# Altium schematic sheet MPPT.SchDoc
size A3
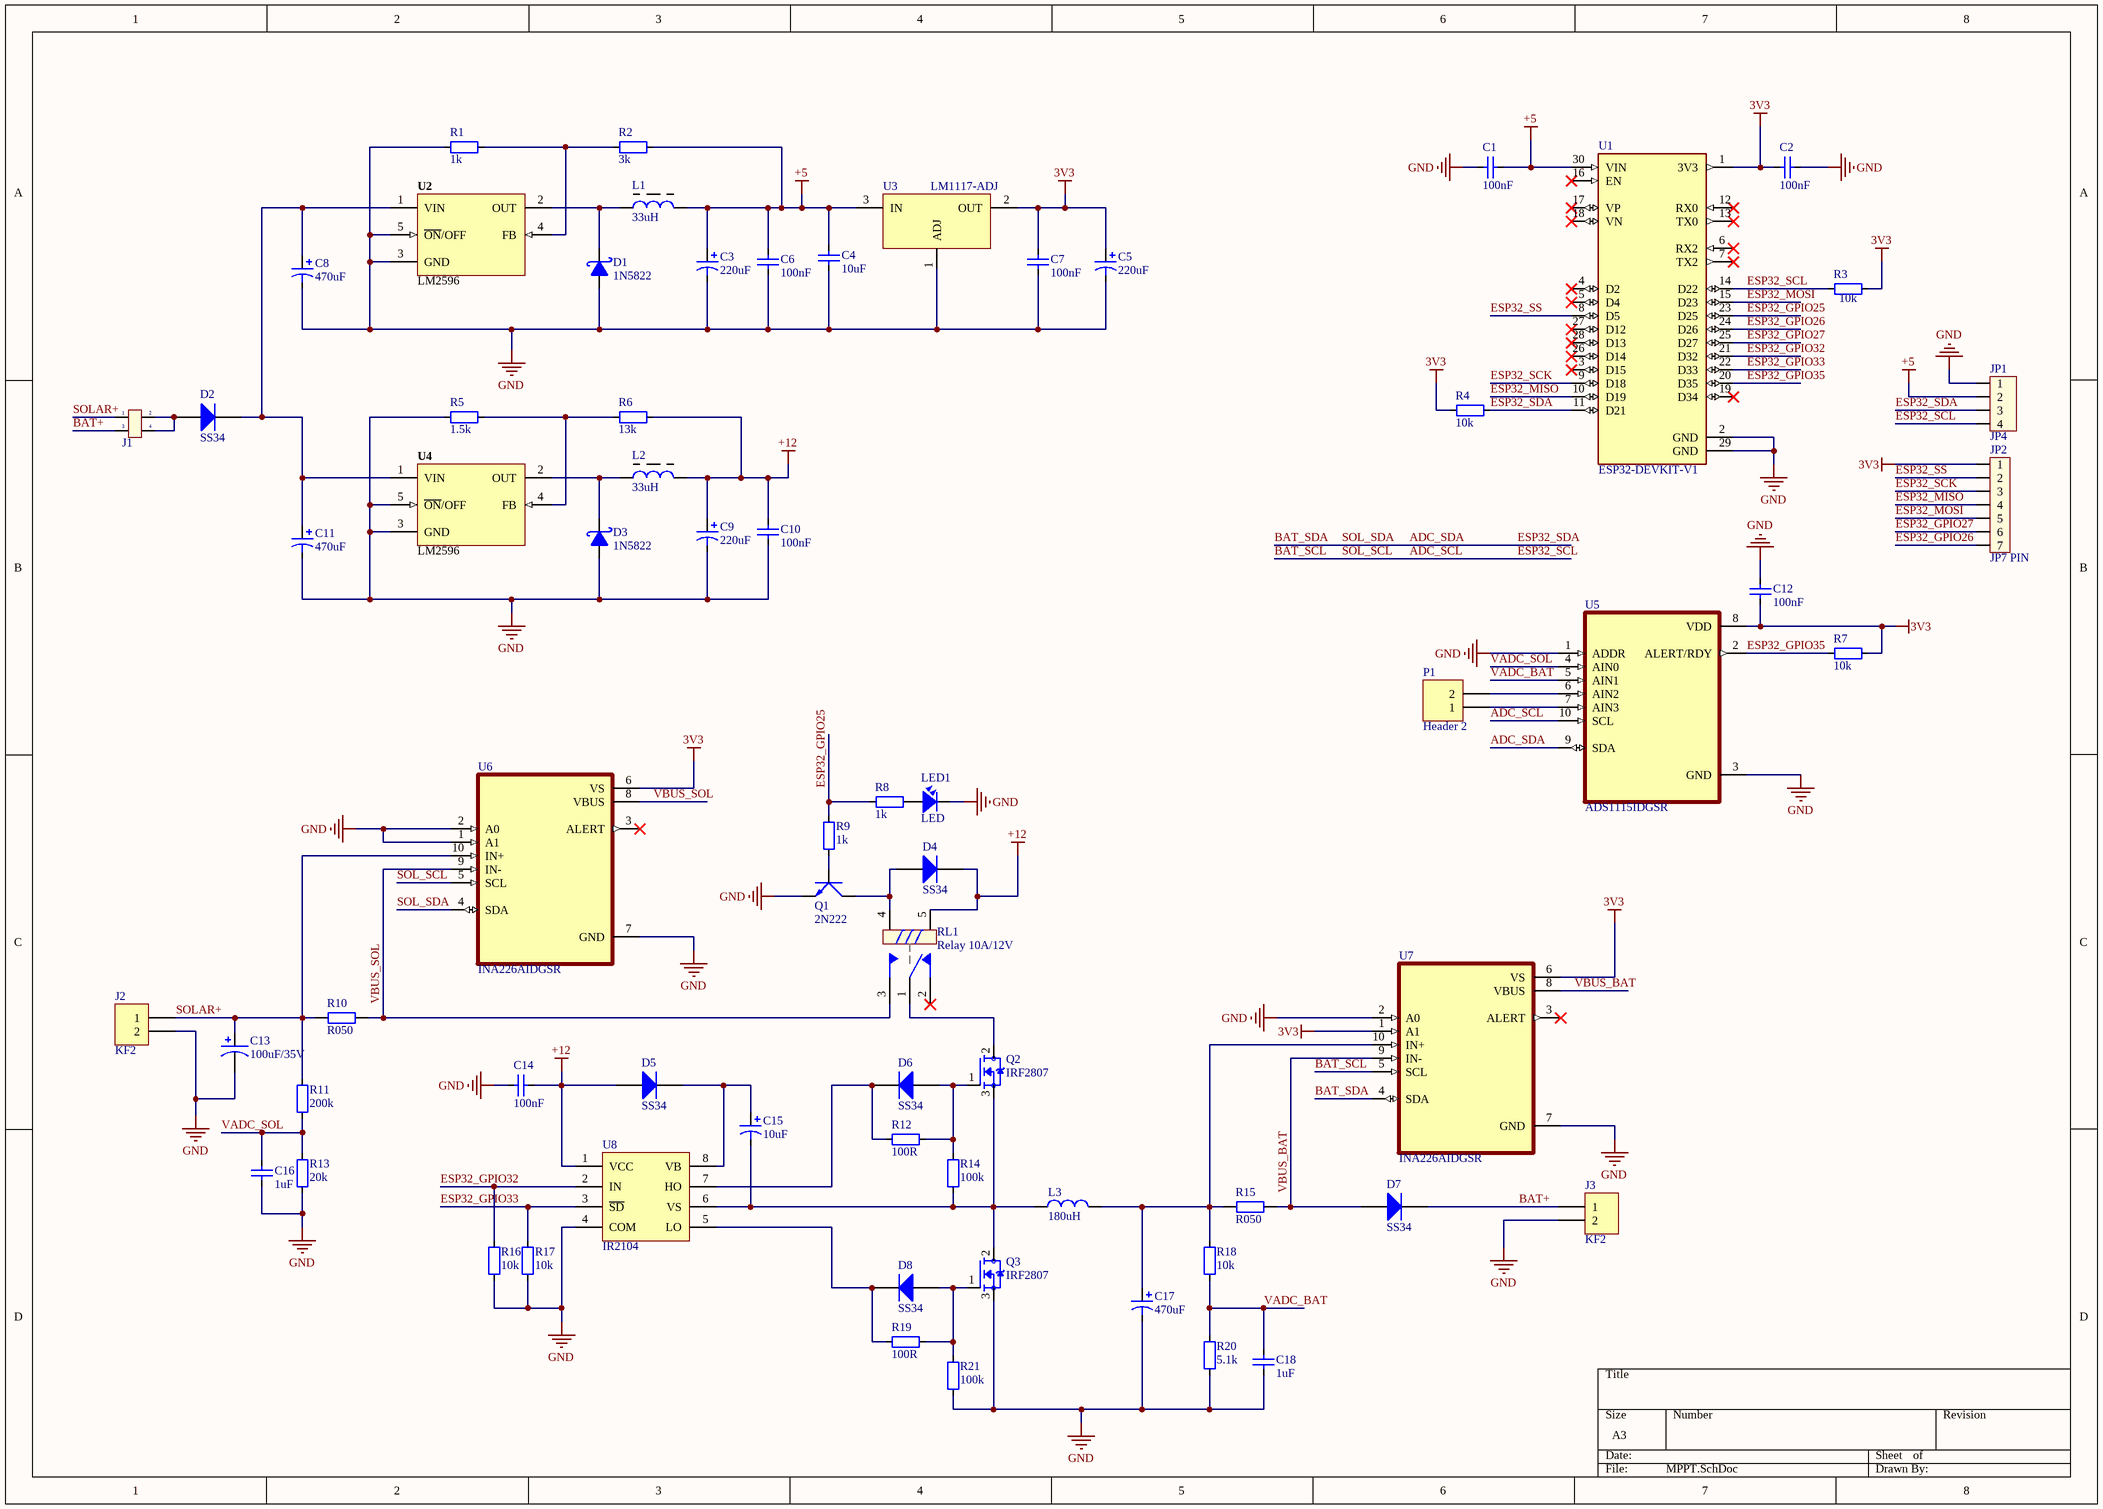
[diagram p0: MPPT.SchDoc]

## Parts
C1  100nF  [CAP_0805]
C2  100nF  [CAP_0805]
C3  220uF  [C8mm]
C4  10uF  [CAP_0805]
C5  220uF  [C8mm]
C6  100nF  [CAP_0805]
C7  100nF  [CAP_0805]
C8  470uF  [C8mm]
C9  220uF  [C8mm]
C10  100nF  [CAP_0805]
C11  470uF  [C8mm]
C12  100nF  [CAP_0805]
C13  100uF/35V  [CA-ALU-6.3]
C14  100nF  [CAP_0805]
C15  10uF  [CAP_35TQC10MYF]
C16  1uF  [CAP_0805]
C17  470uF  [C8mm]
C18  1uF  [CAP_0805]
D1  1N5822  [SMA]
D2  SS34  [SMA]
D3  1N5822  [SMA]
D4  SS34  [SMA]
D5  SS34  [SMA]
D6  SS34  [SMA]
D7  SS34  [SMA]
D8  SS34  [SMA]
J1  Jumper 2x2  [HDR2X2]  (value not drawn)
J2  KF2  [KF2-5.08T]
J3  KF2  [KF2-5.08T]
JP1  JP4  [CON4]
JP2  JP7 PIN  [JP7]
L1  33uH  [L-SMD-M-7.3x4.5]
L2  33uH  [L-SMD-M-7.3x4.5]
L3  180uH  [L-DIP-M-13.5x6]
LED1  LED  [LED-0805-Red]
P1  Header 2  [HDR1X2]
Q1  2N222  [SOT23]
Q2  IRF2807  [TO-220]
Q3  IRF2807  [TO-220]
R1  1k  [RES-SMD-0805]
R2  3k  [RES-SMD-0805]
R3  10k  [RES-SMD-0805]
R4  10k  [RES-SMD-0805]
R5  1.5k  [RES-SMD-0805]
R6  13k  [RES-SMD-0805]
R7  10k  [RES-SMD-0805]
R8  1k  [RES-SMD-0805]
R9  1k  [RES-SMD-0805]
R10  R050  [RES-SMD-2512]
R11  200k  [RES-SMD-0805]
R12  100R  [RES-SMD-0805]
R13  20k  [RES-SMD-0805]
R14  100k  [RES-SMD-0805]
R15  R050  [RES-SMD-2512]
R16  10k  [RES-SMD-0805]
R17  10k  [RES-SMD-0805]
R18  10k  [RES-SMD-0805]
R19  100R  [RES-SMD-0805]
R20  5.1k  [RES-SMD-0805]
R21  100k  [RES-SMD-0805]
RL1  Relay 10A/12V  [RELAY5PIN-10A]
U1  ESP32-DEVKIT-V1  [MODULE_ESP32_DEVKIT_V1]
U2  LM2596  [TO-263]
U3  LM1117-ADJ  [LM1117-SOP]
U4  LM2596  [TO-263]
U5  ADS1115IDGSR  [SOP50P490X110-10N]
U6  INA226AIDGSR  [SOP50P490X110-10N]
U7  INA226AIDGSR  [SOP50P490X110-10N]
U8  IR2104  [SO-8N]

## Nets
3V3: C2.1 C5.1 C7.1 C12.2 JP2.1 R3.1 R4.1 R7.1 U1.1(3V3) U3.2(OUT) U5.8(VDD) U6.6(VS) U7.1(A1) U7.6(VS)
+5: C1.2 C3.1 C4.1 C6.1 JP1.2 L1.2 R2.2 U1.30(VIN) U3.3(IN)
+12: C9.1 C10.1 C14.1 D4.2(K) D5.1(A) L2.2 R6.2 RL1.5 U8.1(VCC)
GND: C1.1 C2.2 C3.2 C4.2 C5.2 C6.2 C7.2 C8.2 C9.2 C10.2 C11.2 C12.1 C13.2 C14.2 C16.2 C17.2 C18.2 D1.1(A) D3.1(A) J2.2 J3.2 JP1.1 LED1.2 Q1.1(E) Q3.3(S) R1.1 R5.1 R13.2 R16.1 R17.1 R20.2 R21.2 U1.2(GND) U1.29(GND) U2.3(GND) U2.5(~{ON}/OFF) U3.1(ADJ) U4.3(GND) U4.5(~{ON}/OFF) U5.1(ADDR) U5.3(GND) U6.1(A1) U6.2(A0) U6.7(GND) U7.2(A0) U7.7(GND) U8.4(COM)
ADC_SCL: JP1.4 R3.2 U1.14(D22) U5.10(SCL) U6.5(SCL) U7.5(SCL)  [also labelled BAT_SCL, ESP32_SCL, SOL_SCL]
ADC_SDA: JP1.3 R4.2 U1.11(D21) U5.9(SDA) U6.4(SDA) U7.4(SDA)  [also labelled BAT_SDA, ESP32_SDA, SOL_SDA]
BAT+: D7.2(K) J1.3 J3.1
ESP32_GPIO25: R8.2 R9.2 U1.23(D25)
ESP32_GPIO26: JP2.7 U1.24(D26)
ESP32_GPIO27: JP2.6 U1.25(D27)
ESP32_GPIO32: R16.2 U1.21(D32) U8.2(IN)
ESP32_GPIO33: R17.2 U1.22(D33) U8.3(~{SD})
ESP32_GPIO35: R7.2 U1.20(D35) U5.2(ALERT/RDY)
ESP32_MISO: JP2.4 U1.10(D19)
ESP32_MOSI: JP2.5 U1.15(D23)
ESP32_SCK: JP2.3 U1.9(D18)
ESP32_SS: JP2.2 U1.8(D5)
SOLAR+: C13.1 J1.1 J2.1 R10.2 R11.2 U6.10(IN+)
VADC_BAT: C18.1 R18.2 R20.1 U5.5(AIN1)
VADC_SOL: C16.1 R11.1 R13.1 U5.4(AIN0)
VBUS_BAT: D7.1(A) R15.1 U7.8(VBUS) U7.9(IN-)
VBUS_SOL: R10.1 RL1.3 U6.8(VBUS) U6.9(IN-)
NetC8_1: C8.1 C11.1 D2.2(K) U2.1(VIN) U4.1(VIN)
NetC15_1: C15.1 D5.2(K) U8.8(VB)
NetC15_2: C15.2 L3.1 Q2.3(S) Q3.2(D) R14.2 U8.6(VS)
NetC17_1: C17.1 L3.2 R15.2 R18.1 U7.10(IN+)
NetD1_2: D1.2(K) L1.1 U2.2(OUT)
NetD2_1: D2.1(A) J1.2 J1.4
NetD3_2: D3.2(K) L2.1 U4.2(OUT)
NetD4_1: D4.1(A) Q1.3(C) RL1.4
NetD6_1: D6.1(A) Q2.1(G) R12.1 R14.1
NetD6_2: D6.2(K) R12.2 U8.7(HO)
NetD8_1: D8.1(A) Q3.1(G) R19.1 R21.1
NetD8_2: D8.2(K) R19.2 U8.5(LO)
NetLED1_1: LED1.1 R8.1
NetP1_1: P1.1 U5.7(AIN3)
NetP1_2: P1.2 U5.6(AIN2)
NetQ1_2: Q1.2(B) R9.1
NetQ2_2: Q2.2(D) RL1.1
NetR1_2: R1.2 R2.1 U2.4(FB)
NetR5_2: R5.2 R6.1 U4.4(FB)

Not connected (* = marked no-connect by the designer): RL1 2*; U1 3(D15)* 4(D2)* 5(D4)* 6(RX2)* 7(TX2)* 12(RX0)* 13(TX0)* 16(EN)* 17(VP)* 18(VN)* 19(D34)* 26(D14)* 27(D12)* 28(D13)*; U6 3(ALERT)*; U7 3(ALERT)*

## Library data of the parts
C1 C2 C4 C6 C7 C10 C12 C14 C16 C18 = CapSMD: Capacitor; Value: 33p; Published: 8-Jun-2000; LatestRevisionDate: 17-Jul-2002; LatestRevisionNote: Re-released for DXP Platform.; PackageReference: RAD-0.3; Publisher: Altium Limited
C3 C5 C9 C15 = Cap Pol: 220uF 25V 6x7mm; Published: 8-Jun-2000; LatestRevisionDate: 17-Jul-2002; LatestRevisionNote: Re-released for DXP Platform.; PackageReference: POLAR0.8; Publisher: Altium Limited
C8 C11 = Cap Pol: 220uF 50V 8x12mm; Published: 8-Jun-2000; LatestRevisionDate: 17-Jul-2002; LatestRevisionNote: Re-released for DXP Platform.; PackageReference: POLAR0.8; Publisher: Altium Limited
C13 = Cap Pol: Polarized Capacitor (Axial); Published: 8-Jun-2000; LatestRevisionDate: 17-Jul-2002; LatestRevisionNote: Re-released for DXP Platform.; PackageReference: POLAR0.8; Publisher: Altium Limited
C17 = Cap Pol: 470uF 50V 8x12mm; Published: 8-Jun-2000; LatestRevisionDate: 17-Jul-2002; LatestRevisionNote: Re-released for DXP Platform.; PackageReference: POLAR0.8; Publisher: Altium Limited
D1 D3 = 1N5822: Schottky Rectifiers; Value: Diode c?m 1N5408
D2 D6-D8 = Diode SS34 ( 1N5822 ): Dán; Don_Vi: Con; Ma_Hang: MH002104; Ten_Linh_Kien: Diode SS34 3A 40V SMA ( 1N5822 SS34A); Kieu_Chan: *; Chung_Loai: Dán
D4 D5 = Diode SS34 ( 1N5822 ): Don_Vi: Con; Chung_Loai: Dán; Ma_Hang: MH002104; Ten_Linh_Kien: Diode SS34 3A 40V SMA ( 1N5822 SS34A); Kieu_Chan: *
J1 = JP2x2: Value: JP 2x2
J2 J3 = KF2: Manufacturer: Würth Elektronik eiSos GmbH; partNo: 691103110002; ComponentLink1 Description: Manufacturer; ComponentLink2 Description: Datasheet; NoPins: 2; Created Date: 29 October 2013; ComponentLink1URL: http://www.we-online.com; ComponentLink2URL: http://katalog.we-online.de/em/datasheet/6911031100xx.pdf; Created by: Karrer Zheng
JP1 = Con4: Connector 4; Value: Connector 4
JP2 = JP7: Value: JP7
L1 L2 = Inductor Ferit: 33uH CD127 3A 12x12x7mm; Value: 150 mH
L3 = Inductor: 180uH 4A 13mm; Value: 150 mH
LED1 = LED: LED Single colour Green and Red; Value: LED 3 ly Single Colour
P1 = Header 2: Header, 2-Pin; LatestRevisionDate: 17-Jul-2002; LatestRevisionNote: Re-released for DXP Platform.; Publisher: Altium Limited
Q1 = 2N222: NPN 600mW, ECB; Value: C1815
R1-R9 R11-R14 R16-R21 = Resistor - SMD: Resistor; Manufacturer: Generic Components; Class: Passive; Published: 08/06/2000; Publisher: Altium Hobart Technology Centre
R10 R15 = Resistor - SMD: Resistor SMD; Manufacturer: Generic Components; Class: Passive; Published: 08/06/2000; Publisher: Altium Hobart Technology Centre
RL1 = Relay 5: Relay SPDT,10A - 12VDC 5 Pin; Value: Relay SPDT, 10A, 12V
U1 = ESP32-DEVKIT-V1: Dual core, Wi-Fi: 2.4 GHz up to 150 Mbits/s,BLE (Bluetooth Low Energy) and legacy Bluetooth, 32 bits, Up to 240 MHz; Value: *; MP: ESP32-DEVKIT-V1; Availability: Unavailable; Package: None; Price: None
U2 U4 = LM2596: Max Input Voltage: 12 V; Max Output Current: 3 (6.0 peak) A; Max Output Voltage: mV; Category: IC-Power; Min Input Voltage: mV; Min Output Voltage: mV; Mounting Technology: Surface Mount; Status: Unreleased; Supply Voltage: mV; Temperature Range: -40 to +125 degC
U3 = LM1117-ADJ: 800mA Low-Dropout Linear Regulator; Creator: Nguyen Ba Bien; Website: http://group3i.net
U6 U7 = INA226AIDGSR: 36V, 16-bit, ultra-precise i2c output current/voltage/power monitor w/alert 10-VSSOP -40 to 125; MF: Texas Instruments; Arrow_Electronics-Purchase-URL: https://snapeda.com/shop?store=Arrow+Electronics&id=53552; Texas_Instruments-Purchase-URL: https://snapeda.com/shop?store=Texas+Instruments&id=53552; SnapEDA_Link: https://www.snapeda.com/parts/INA226AIDGSR/Texas%20Instruments/view-part/53552/?ref=snap; Value: *; MP: INA226AIDGSR; Package: VSSOP-10 Texas Instruments; DigiKey-Purchase-URL: https://snapeda.com/shop?store=DigiKey&id=53552; Availability: Good; Price: None; Mouser-Purchase-URL: https://snapeda.com/shop?store=Mouser&id=53552; BuyPart: https://www.snapeda.com/parts/INA226AIDGSR/Texas%20Instruments/view-part/53552/?ref=eda
U8 = IR2184: Half-Bridge Driver
U5 = ADS1115IDGSR: Package: None; Availability: Unavailable; Value: *; MP: ADS1115IDGSR; Price: None